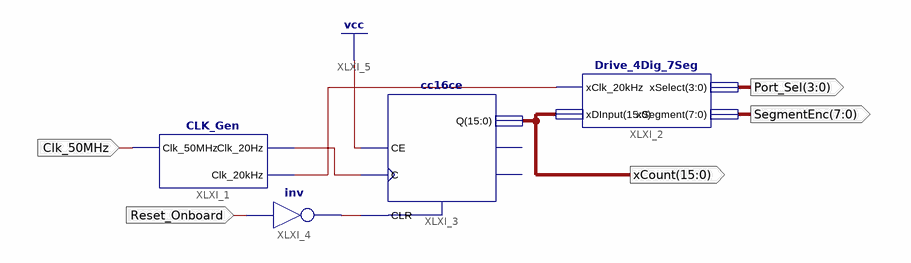
[diagram p0: schematic sheet 1]
// Xilinx ISE schematic abc.sch (spartan6) as structural Verilog: 4 symbols, 5 ports
module abc (
  input  Clk_50MHz,
  input  Reset_Onboard,
  output [15:0] xCount,
  output [3:0] Port_Sel,
  output [7:0] SegmentEnc
);

  wire XLXN_4, XLXN_10, XLXN_11;

  CLK_Gen XLXI_1 (.Clk_50MHz(Clk_50MHz), .Clk_20Hz(XLXN_11), .Clk_20kHz(XLXN_10));
  Drive_4Dig_7Seg XLXI_2 (.xClk_20kHz(XLXN_10), .xDInput(xCount), .xSelect(Port_Sel), .xSegment(SegmentEnc));
  cc16ce XLXI_3 (.C(XLXN_11), .CE(1'b1), .CLR(XLXN_4), .Q(xCount));  // open: CEO, TC
  not XLXI_4 (XLXN_4, Reset_Onboard);
endmodule
